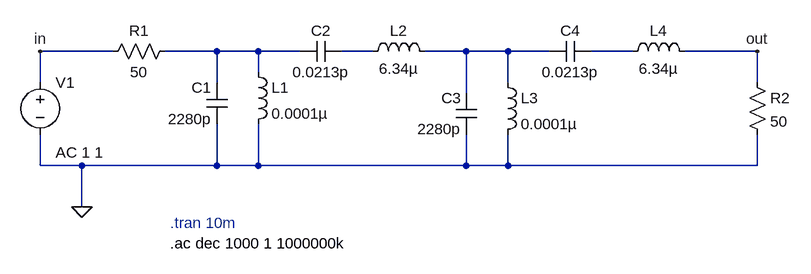
[diagram p0: schematic Band_pass_filter_2.asc]
Band_pass_filter_2.asc, the LTspice schematic file:
Version 4.1
SHEET 1 1416 680
WIRE 80 80 -32 80
WIRE 240 80 160 80
WIRE 304 80 240 80
WIRE 368 80 304 80
WIRE 480 80 432 80
WIRE 624 80 560 80
WIRE 688 80 624 80
WIRE 752 80 688 80
WIRE 880 80 816 80
WIRE 1072 80 960 80
WIRE 304 112 304 80
WIRE -32 128 -32 80
WIRE 240 128 240 80
WIRE 688 128 688 80
WIRE 1072 128 1072 80
WIRE 624 144 624 80
WIRE -32 256 -32 208
WIRE 32 256 -32 256
WIRE 240 256 240 192
WIRE 240 256 32 256
WIRE 304 256 304 192
WIRE 304 256 240 256
WIRE 624 256 624 208
WIRE 624 256 304 256
WIRE 688 256 688 208
WIRE 688 256 624 256
WIRE 1072 256 1072 208
WIRE 1072 256 688 256
WIRE 32 320 32 256
FLAG 32 320 0
FLAG 1072 80 out
FLAG -32 80 in
SYMBOL voltage -32 112 R0
WINDOW 123 24 124 Left 2
WINDOW 39 0 0 Left 0
SYMATTR InstName V1
SYMATTR Value ""
SYMATTR Value2 AC 1 1
SYMBOL ind 288 96 R0
SYMATTR InstName L1
SYMATTR Value 0.0001µ
SYMBOL ind 464 96 R270
WINDOW 0 32 56 VTop 2
WINDOW 3 5 56 VBottom 2
SYMATTR InstName L2
SYMATTR Value 6.34µ
SYMBOL cap 256 192 R180
WINDOW 0 24 56 Left 2
WINDOW 3 24 8 Left 2
SYMATTR InstName C1
SYMATTR Value 2280p
SYMBOL cap 432 64 R90
WINDOW 0 0 32 VBottom 2
WINDOW 3 32 32 VTop 2
SYMATTR InstName C2
SYMATTR Value 0.0213p
SYMBOL ind 672 112 R0
SYMATTR InstName L3
SYMATTR Value 0.0001µ
SYMBOL cap 640 208 R180
WINDOW 0 24 56 Left 2
WINDOW 3 24 8 Left 2
SYMATTR InstName C3
SYMATTR Value 2280p
SYMBOL res 176 64 R90
WINDOW 0 0 56 VBottom 2
WINDOW 3 32 56 VTop 2
SYMATTR InstName R1
SYMATTR Value 50
SYMBOL res 1056 112 R0
SYMATTR InstName R2
SYMATTR Value 50
SYMBOL ind 864 96 R270
WINDOW 0 32 56 VTop 2
WINDOW 3 5 56 VBottom 2
SYMATTR InstName L4
SYMATTR Value 6.34µ
SYMBOL cap 816 64 R90
WINDOW 0 0 32 VBottom 2
WINDOW 3 32 32 VTop 2
SYMATTR InstName C4
SYMATTR Value 0.0213p
TEXT 168 344 Left 2 ;.tran 10m
TEXT 168 376 Left 2 !.ac dec 1000 1 1000000k

The netlist it stands for:
* Band_pass_filter_2.asc
V1 in 0 AC 1 1
L1 N001 0 0.0001µ
L2 N002 N003 6.34µ
C1 0 N001 2280p
C2 N002 N001 0.0213p
L3 N003 0 0.0001µ
C3 0 N003 2280p
R1 N001 in 50
R2 out 0 50
L4 N004 out 6.34µ
C4 N004 N003 0.0213p
* .tran 10m
.ac dec 1000 1 1000000k
.backanno
.end